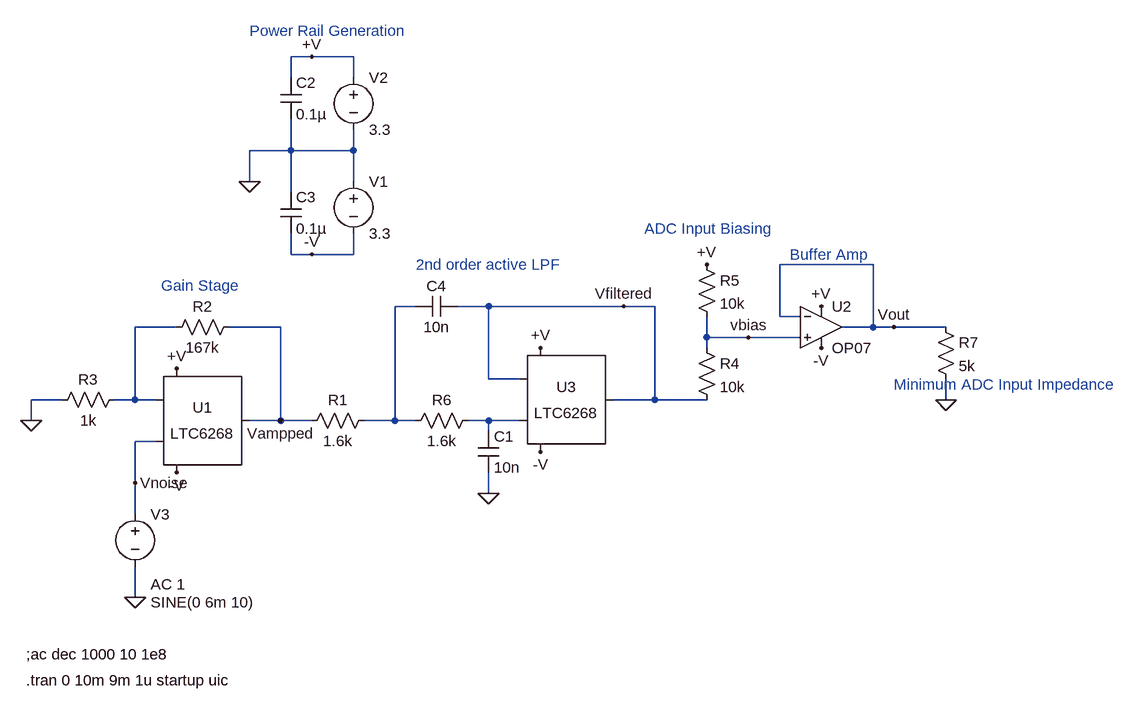
[diagram p0: schematic input_noise_sims.asc]
input_noise_sims.asc, the LTspice schematic file:
Version 4
SHEET 1 1700 680
WIRE 384 -416 352 -416
WIRE 448 -416 384 -416
WIRE 352 -384 352 -416
WIRE 448 -384 448 -416
WIRE 352 -272 352 -320
WIRE 352 -272 288 -272
WIRE 448 -272 448 -304
WIRE 448 -272 352 -272
WIRE 288 -224 288 -272
WIRE 448 -224 448 -272
WIRE 352 -208 352 -272
WIRE 352 -112 352 -144
WIRE 384 -112 352 -112
WIRE 448 -112 448 -144
WIRE 448 -112 384 -112
WIRE 1248 -96 1104 -96
WIRE 544 -32 512 -32
WIRE 656 -32 608 -32
WIRE 864 -32 656 -32
WIRE 912 -32 864 -32
WIRE 1104 -16 1104 -96
WIRE 1136 -16 1104 -16
WIRE 176 0 112 0
WIRE 336 0 256 0
WIRE 1248 0 1248 -96
WIRE 1248 0 1200 0
WIRE 1280 0 1248 0
WIRE 1360 0 1280 0
WIRE 992 16 992 -16
WIRE 1056 16 992 16
WIRE 1136 16 1056 16
WIRE 992 32 992 16
WIRE 656 80 656 -32
WIRE 704 80 656 80
WIRE 0 112 -48 112
WIRE 112 112 112 0
WIRE 112 112 80 112
WIRE 144 112 112 112
WIRE 912 112 912 -32
WIRE 912 112 848 112
WIRE 992 112 912 112
WIRE 1360 112 1360 80
WIRE -48 144 -48 112
WIRE 336 144 336 0
WIRE 336 144 288 144
WIRE 384 144 336 144
WIRE 512 144 512 -32
WIRE 512 144 464 144
WIRE 544 144 512 144
WIRE 656 144 624 144
WIRE 704 144 656 144
WIRE 656 160 656 144
WIRE 144 176 112 176
WIRE 112 240 112 176
WIRE 656 256 656 224
WIRE 112 288 112 240
WIRE 112 416 112 368
FLAG 656 256 0
FLAG 112 416 0
FLAG 176 64 +V
FLAG 176 224 -V
FLAG 336 144 Vampped
FLAG -48 144 0
FLAG 112 240 Vnoise
FLAG 992 -96 +V
FLAG 288 -224 0
FLAG 384 -416 +V
FLAG 384 -112 -V
FLAG 1168 -32 +V
FLAG 1168 32 -V
FLAG 1360 112 0
FLAG 1280 0 Vout
FLAG 1056 16 vbias
FLAG 736 32 +V
FLAG 736 192 -V
FLAG 864 -32 Vfiltered
SYMBOL Opamps\\LTC6268 176 144 R0
SYMATTR InstName U1
SYMBOL voltage 448 -240 R0
WINDOW 123 0 0 Left 0
WINDOW 39 0 0 Left 0
SYMATTR InstName V1
SYMATTR Value 3.3
SYMBOL voltage 448 -400 R0
WINDOW 123 0 0 Left 0
WINDOW 39 0 0 Left 0
SYMATTR InstName V2
SYMATTR Value 3.3
SYMBOL cap 640 160 R0
SYMATTR InstName C1
SYMATTR Value 10n
SYMBOL res 480 128 R90
WINDOW 0 0 56 VBottom 2
WINDOW 3 32 56 VTop 2
SYMATTR InstName R1
SYMATTR Value 1.6k
SYMBOL res 272 -16 R90
WINDOW 0 0 56 VBottom 2
WINDOW 3 32 56 VTop 2
SYMATTR InstName R2
SYMATTR Value 167k
SYMBOL res 96 96 R90
WINDOW 0 0 56 VBottom 2
WINDOW 3 32 56 VTop 2
SYMATTR InstName R3
SYMATTR Value 1k
SYMBOL res 976 16 R0
SYMATTR InstName R4
SYMATTR Value 10k
SYMBOL res 976 -112 R0
SYMATTR InstName R5
SYMATTR Value 10k
SYMBOL cap 336 -384 R0
SYMATTR InstName C2
SYMATTR Value 0.1µ
SYMBOL cap 336 -208 R0
SYMATTR InstName C3
SYMATTR Value 0.1µ
SYMBOL res 1344 -16 R0
SYMATTR InstName R7
SYMATTR Value 5k
SYMBOL voltage 112 272 R0
WINDOW 3 24 152 Left 2
WINDOW 123 24 124 Left 2
WINDOW 39 0 0 Left 0
SYMATTR Value SINE(0 6m 10)
SYMATTR Value2 AC 1
SYMATTR InstName V3
SYMBOL Opamps\\OP07 1168 -64 R0
SYMATTR InstName U2
SYMBOL res 640 128 R90
WINDOW 0 0 56 VBottom 2
WINDOW 3 32 56 VTop 2
SYMATTR InstName R6
SYMATTR Value 1.6k
SYMBOL Opamps\\LTC6268 736 112 R0
SYMATTR InstName U3
SYMBOL cap 608 -48 R90
WINDOW 0 0 32 VBottom 2
WINDOW 3 32 32 VTop 2
SYMATTR InstName C4
SYMATTR Value 10n
TEXT 152 -64 Left 2 ;Gain Stage
TEXT 896 -152 Left 2 ;ADC Input Biasing
TEXT 288 -456 Left 2 ;Power Rail Generation
TEXT 544 -96 Left 2 ;2nd order active LPF
TEXT 1120 -112 Left 2 ;Buffer Amp
TEXT 1280 88 Left 2 ;Minimum ADC Input Impedance
TEXT -56 544 Left 2 !.tran 0 10m 9m 1u startup uic
TEXT -56 504 Left 2 !;ac dec 1000 10 1e8

The netlist it stands for:
* input_noise_sims.asc
XU1 Vnoise N002 Vampped +V -V NC_01 LTC6268
V1 0 -V 3.3
V2 +V 0 3.3
C1 N003 0 10n
R1 N001 Vampped 1.6k
R2 Vampped N002 167k
R3 N002 0 1k
R4 vbias Vfiltered 10k
R5 +V vbias 10k
C2 +V 0 0.1µ
C3 0 -V 0.1µ
R7 Vout 0 5k
V3 Vnoise 0 SINE(0 6m 10) AC 1
XU2 vbias Vout +V -V Vout LT1001  ; OP07, pins In+ In- V+ V- OUT
R6 N003 N001 1.6k
XU3 N003 Vfiltered Vfiltered +V -V NC_02 LTC6268
C4 Vfiltered N001 10n
* Gain Stage
* ADC Input Biasing
* Power Rail Generation
* 2nd order active LPF
* Buffer Amp
* Minimum ADC Input Impedance
.tran 0 10m 9m 1u startup uic
;ac dec 1000 10 1e8
.lib LTC2.lib
.lib LTC.lib
.backanno
.end